# EAGLE board Aeternum_V1_2 (EAGLE 9.1.1)
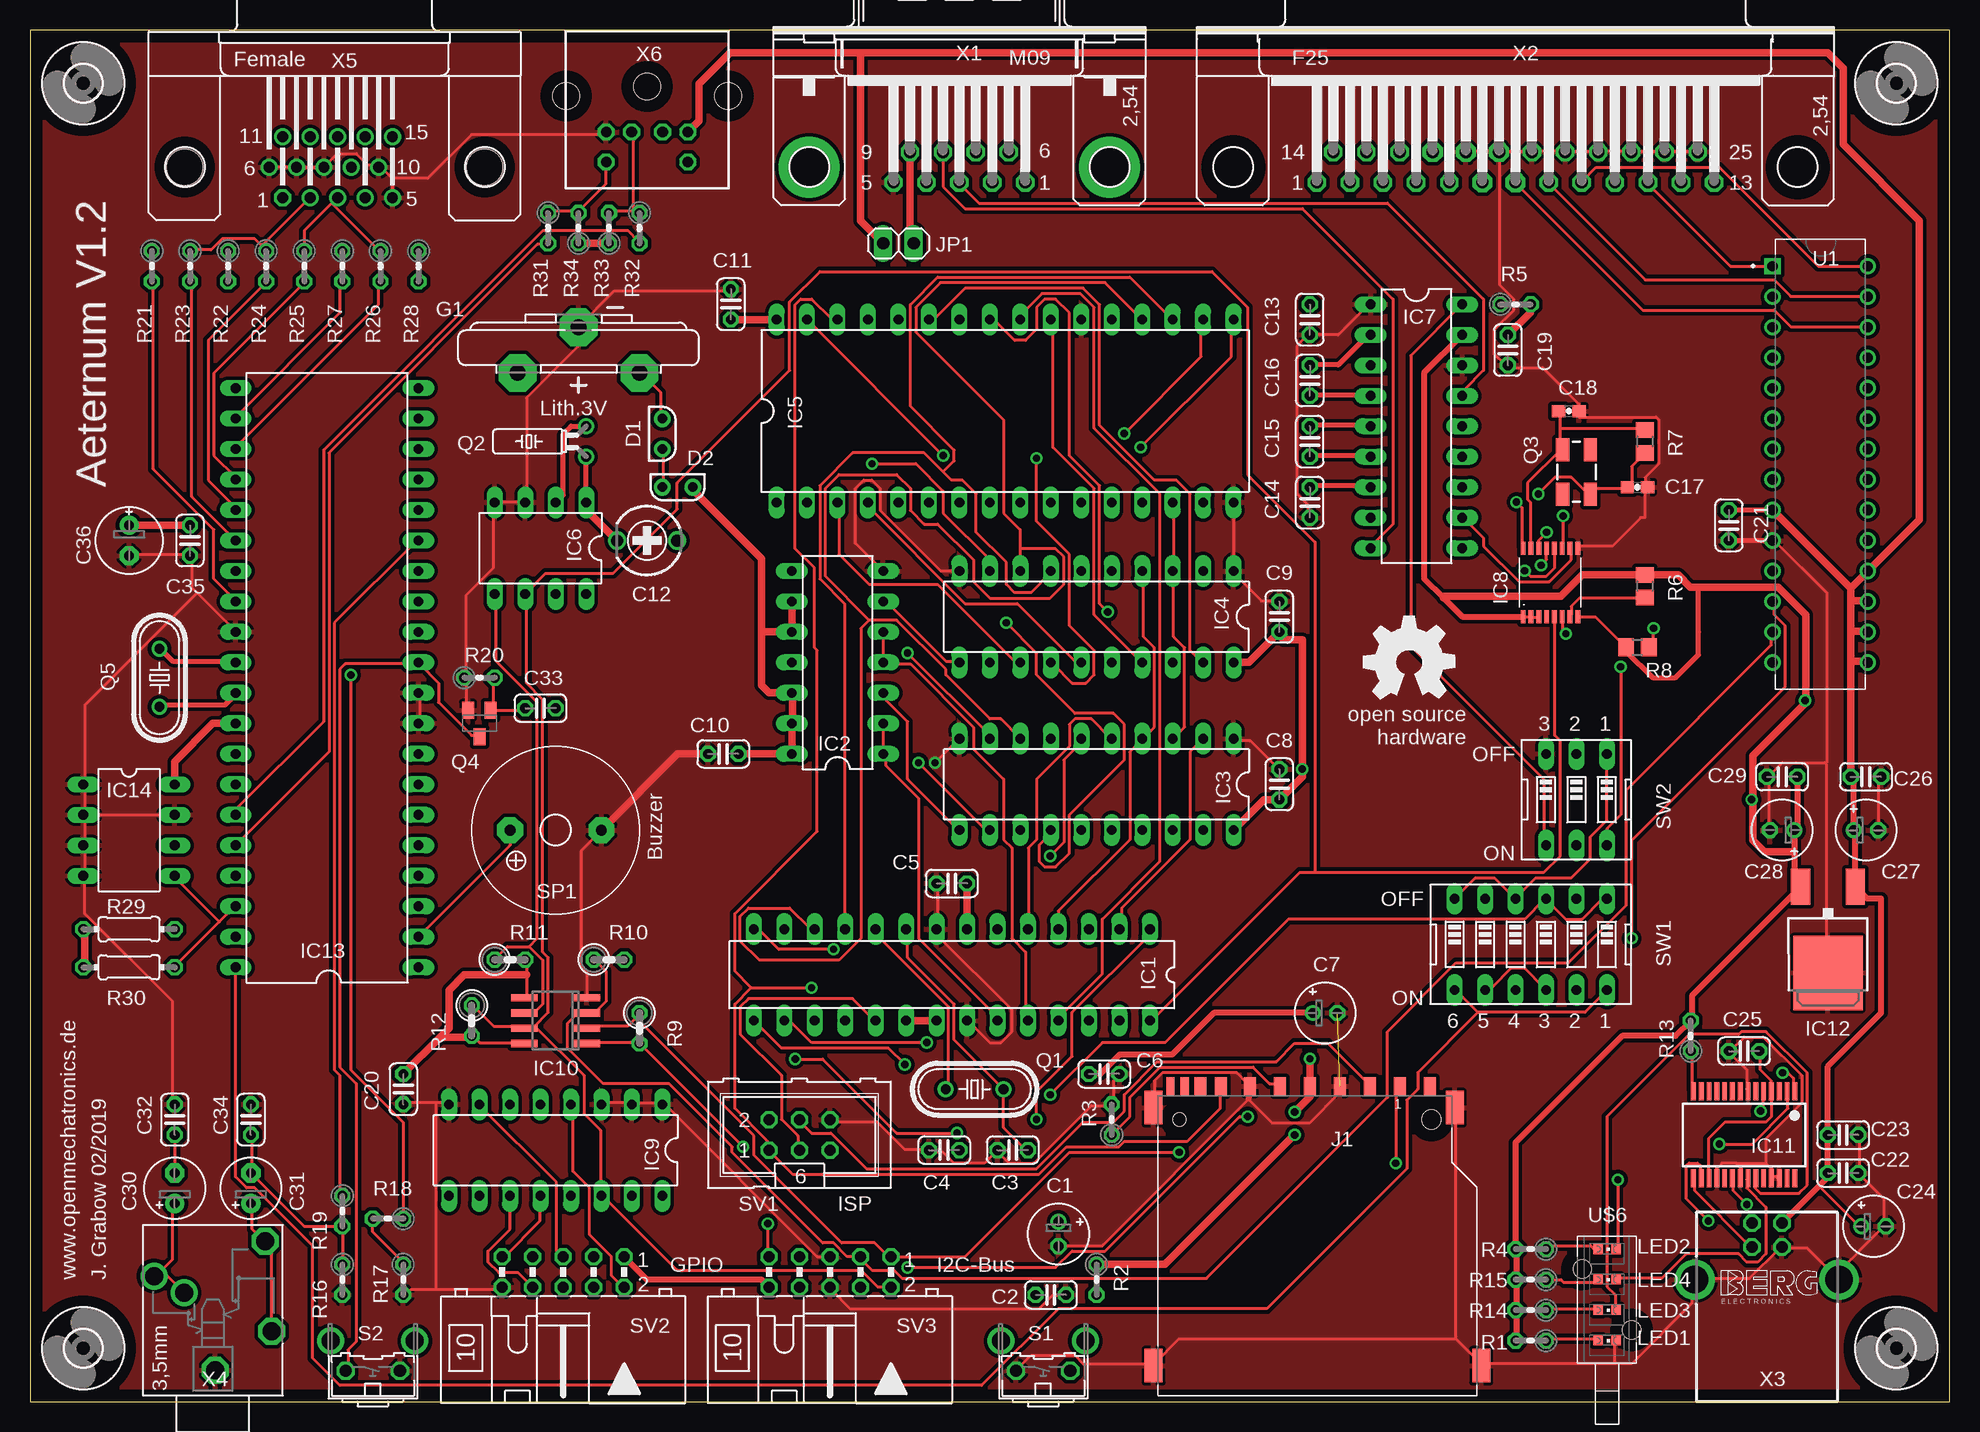
[diagram p5: board, top side]
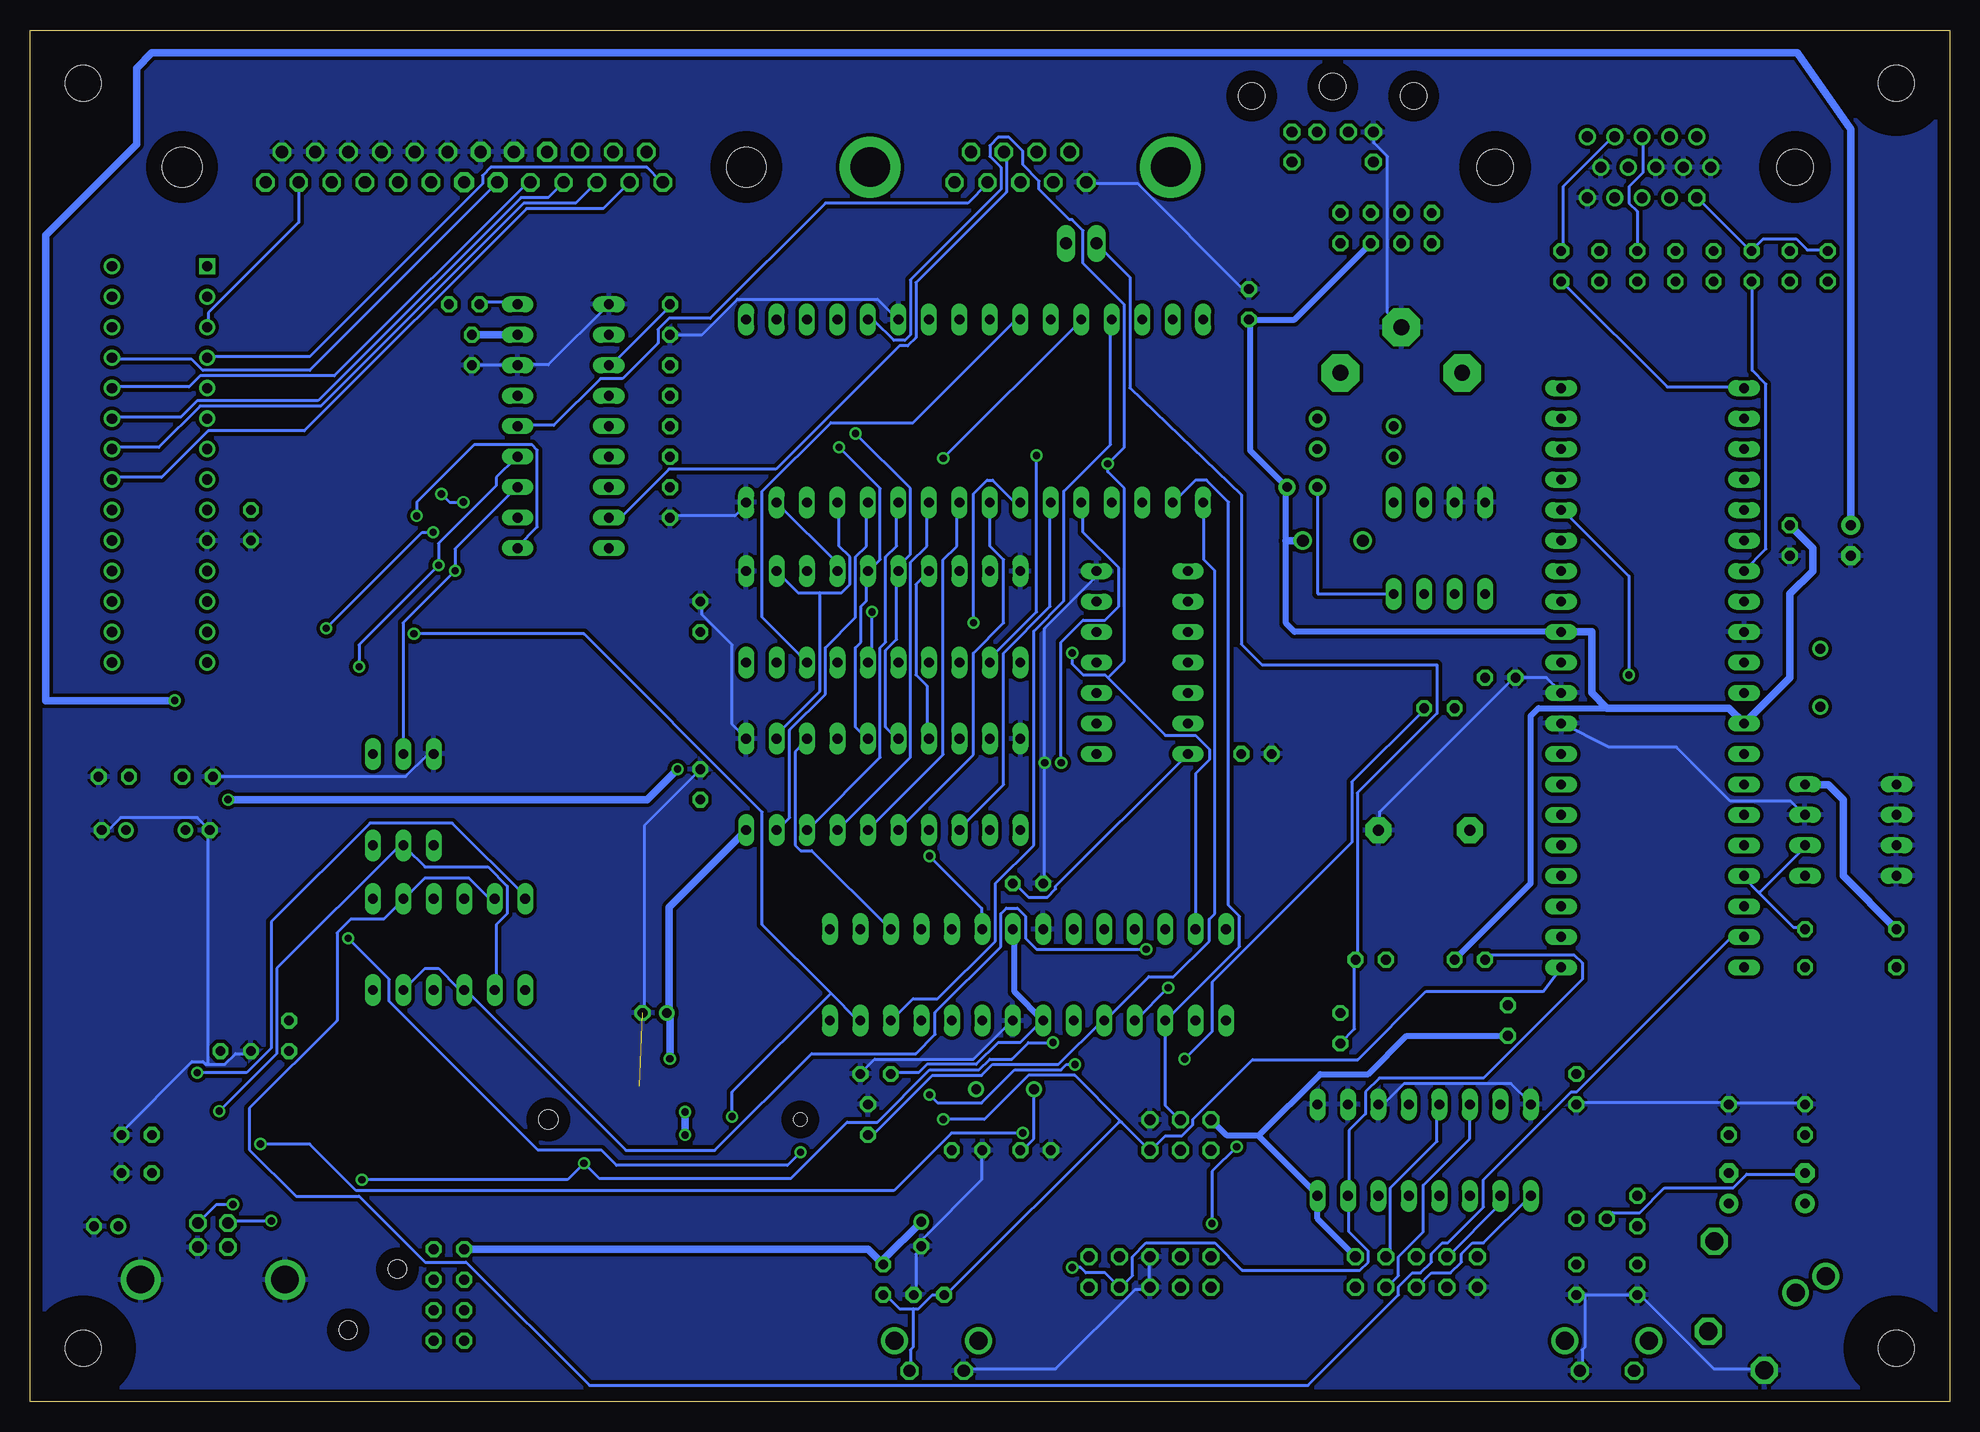
[diagram p6: board, bottom side, seen from below]

Size 160.02 x 114.3 mm. Coordinates in mm from the lower left corner, seen from the top.
Outline: 160.02,0 160.02,114.3 0,114.3 0,0 160.02,0
Copper layers (1*16): Top 0.035mm / dielectric 1.5mm / Bottom 0.035mm
Design rules "default": minimum track width 10mil, minimum drill 24mil, track to track 8mil, track to pad 8mil, pad to pad 8mil, via to via 8mil, smd to smd 8mil, copper to edge 40mil, drill to drill 8mil, minimum pad ring 10mil, minimum via ring 8mil, stop-mask expansion 4mil, vias tented up to drill 0mil, thermal gap 10mil

## Footprints (pad centres in the part's own frame; a part is rotated, then mirrored left to right if it is on the bottom)
E2-5 = drill 0.813 pad 1.27: + -1.016,0 | drill 0.813 pad 1.27 octagon: - 1.016,0
C025-024X044 = drill 0.813 octagon: 1 -1.27,0; 2 1.27,0
CTRIMTZ03 = drill 1: 1 0,2.5; 2 0,-2.5
0603-CAP = smd 1.1 x 1: 1 -0.85,0; 2 0.85,0
E2,5-5 = drill 0.813 pad 1.6: + -1.27,0 | drill 0.813 pad 1.6 octagon: - 1.27,0
E2,5-6E = drill 0.813 pad 1.575: + -1.27,0 | drill 0.813 pad 1.575 octagon: - 1.27,0
E2LINE = drill 0.8 pad 1.397: 1 0,-1.27; 2 0,1.27
KZH20PCB-V = drill 1.321 pad 3.15 octagon: + 0,-5.08; +@1 0,5.08; - 3.81,0
DIL28-3 = drill 0.813 long: 1 -16.51,-3.81; 2 -13.97,-3.81; 3 -11.43,-3.81; 4 -8.89,-3.81; 5 -6.35,-3.81; 6 -3.81,-3.81; 7 -1.27,-3.81; 8 1.27,-3.81; 9 3.81,-3.81; 10 6.35,-3.81; 11 8.89,-3.81; 12 11.43,-3.81; 13 13.97,-3.81; 14 16.51,-3.81; 15 16.51,3.81; 16 13.97,3.81; 17 11.43,3.81; 18 8.89,3.81; 19 6.35,3.81; 20 3.81,3.81; 21 1.27,3.81; 22 -1.27,3.81; 23 -3.81,3.81; 24 -6.35,3.81; 25 -8.89,3.81; 26 -11.43,3.81; 27 -13.97,3.81; 28 -16.51,3.81
DIL14 = drill 0.813 long: 1 -7.62,-3.81; 2 -5.08,-3.81; 3 -2.54,-3.81; 4 0,-3.81; 5 2.54,-3.81; 6 5.08,-3.81; 7 7.62,-3.81; 8 7.62,3.81; 9 5.08,3.81; 10 2.54,3.81; 11 0,3.81; 12 -2.54,3.81; 13 -5.08,3.81; 14 -7.62,3.81
DIL20 = drill 0.813 long: 1 -11.43,-3.81; 2 -8.89,-3.81; 3 -6.35,-3.81; 4 -3.81,-3.81; 5 -1.27,-3.81; 6 1.27,-3.81; 7 3.81,-3.81; 8 6.35,-3.81; 9 8.89,-3.81; 10 11.43,-3.81; 11 11.43,3.81; 12 8.89,3.81; 13 6.35,3.81; 14 3.81,3.81; 15 1.27,3.81; 16 -1.27,3.81; 17 -3.81,3.81; 18 -6.35,3.81; 19 -8.89,3.81; 20 -11.43,3.81
DIL32 = drill 0.813 long: 1 -17.78,-7.62; 2 -15.24,-7.62; 3 -12.7,-7.62; 4 -10.16,-7.62; 5 -7.62,-7.62; 6 -5.08,-7.62; 7 -2.54,-7.62; 8 0,-7.62; 9 2.54,-7.62; 10 5.08,-7.62; 11 7.62,-7.62; 12 10.16,-7.62; 13 12.7,-7.62; 14 15.24,-7.62; 15 17.78,-7.62; 16 20.32,-7.62; 17 20.32,7.62; 18 17.78,7.62; 19 15.24,7.62; 20 12.7,7.62; 21 10.16,7.62; 22 7.62,7.62; 23 5.08,7.62; 24 2.54,7.62; 25 0,7.62; 26 -2.54,7.62; 27 -5.08,7.62; 28 -7.62,7.62; 29 -10.16,7.62; 30 -12.7,7.62; 31 -15.24,7.62; 32 -17.78,7.62
DIL08 = drill 0.813 long: 1 -3.81,-3.81; 2 -1.27,-3.81; 3 1.27,-3.81; 4 3.81,-3.81; 5 3.81,3.81; 6 1.27,3.81; 7 -1.27,3.81; 8 -3.81,3.81
DIL18 = drill 0.813 long: 1 -10.16,-3.81; 2 -7.62,-3.81; 3 -5.08,-3.81; 4 -2.54,-3.81; 5 0,-3.81; 6 2.54,-3.81; 7 5.08,-3.81; 8 7.62,-3.81; 9 10.16,-3.81; 10 10.16,3.81; 11 7.62,3.81; 12 5.08,3.81; 13 2.54,3.81; 14 0,3.81; 15 -2.54,3.81; 16 -5.08,3.81; 17 -7.62,3.81; 18 -10.16,3.81
RICKK2_SC16IS740 = smd 0.4 x 1.1: 1 0,0; 2 0.65,0; 3 1.3,0; 4 1.95,0; 5 2.6,0; 6 3.25,0; 7 3.9,0; 8 4.55,0; 9 4.55,5.7; 10 3.9,5.7; 11 3.25,5.7; 12 2.6,5.7; 13 1.95,5.7; 14 1.3,5.7; 15 0.65,5.7; 16 0,5.7
DIL16 = drill 0.813 long: 1 -8.89,-3.81; 2 -6.35,-3.81; 3 -3.81,-3.81; 4 -1.27,-3.81; 5 1.27,-3.81; 6 3.81,-3.81; 7 6.35,-3.81; 8 8.89,-3.81; 9 8.89,3.81; 10 6.35,3.81; 11 3.81,3.81; 12 1.27,3.81; 13 -1.27,3.81; 14 -3.81,3.81; 15 -6.35,3.81; 16 -8.89,3.81
SO-08 = smd 0.6 x 2.2: 1 -1.905,-2.6; 2 -0.635,-2.6; 3 0.635,-2.6; 4 1.905,-2.6; 5 1.905,2.6; 6 0.635,2.6; 7 -0.635,2.6; 8 -1.905,2.6
SSOP28 = smd 0.4 x 1.5: 1 -4.225,-3.625; 2 -3.575,-3.625; 3 -2.925,-3.625; 4 -2.275,-3.625; 5 -1.625,-3.625; 6 -0.975,-3.625; 7 -0.325,-3.625; 8 0.325,-3.625; 9 0.975,-3.625; 10 1.625,-3.625; 11 2.275,-3.625; 12 2.925,-3.625; 13 3.575,-3.625; 14 4.225,-3.625; 15 4.225,3.625; 16 3.575,3.625; 17 2.925,3.625; 18 2.275,3.625; 19 1.625,3.625; 20 0.975,3.625; 21 0.325,3.625; 22 -0.325,3.625; 23 -0.975,3.625; 24 -1.625,3.625; 25 -2.275,3.625; 26 -2.925,3.625; 27 -3.575,3.625; 28 -4.225,3.625
DPACK = smd 1.6 x 3: 1 -2.28,-4.8; 3 2.28,-4.8 | smd 5.8 x 6.2: 4 0,2.38
DIL40 = drill 0.813 long: 1 -22.86,-7.62; 2 -20.32,-7.62; 3 -17.78,-7.62; 4 -15.24,-7.62; 5 -12.7,-7.62; 6 -10.16,-7.62; 7 -7.62,-7.62; 8 -5.08,-7.62; 9 -2.54,-7.62; 10 0,-7.62; 11 2.54,-7.62; 12 5.08,-7.62; 13 7.62,-7.62; 14 10.16,-7.62; 15 12.7,-7.62; 16 15.24,-7.62; 17 17.78,-7.62; 18 20.32,-7.62; 19 22.86,-7.62; 20 25.4,-7.62; 21 25.4,7.62; 22 22.86,7.62; 23 20.32,7.62; 24 17.78,7.62; 25 15.24,7.62; 26 12.7,7.62; 27 10.16,7.62; 28 7.62,7.62; 29 5.08,7.62; 30 2.54,7.62; 31 0,7.62; 32 -2.54,7.62; 33 -5.08,7.62; 34 -7.62,7.62; 35 -10.16,7.62; 36 -12.7,7.62; 37 -15.24,7.62; 38 -17.78,7.62; 39 -20.32,7.62; 40 -22.86,7.62
DIL8 = drill 0.813 long: 1 -3.81,-3.81; 2 -1.27,-3.81; 3 1.27,-3.81; 4 3.81,-3.81; 5 3.81,3.81; 6 1.27,3.81; 7 -1.27,3.81; 8 -3.81,3.81
693063010911 = smd 1 x 1.5: 1 6.875,2.8; 2 4.375,2.8; 3 1.875,2.8; 4 -0.625,2.8; 5 -3.125,2.8; 6 -5.625,2.8; 7 -8.05,2.8; 8 -9.75,2.8; 9 9.375,2.8 | smd 0.7 x 1.5: CDI -11.05,2.8; WP -12.25,2.8 | smd 1.5 x 2.8: Z1 -13.65,1; Z2 11.45,1; Z3 13.65,-20.5; Z4 -13.65,-20.5 | hole 1.1: -11.5,0 | hole 1.6: 9.5,0
1X02 = drill 1.016 long: 1 -1.27,0; 2 1.27,0
CHIPLED_0603 = smd 0.8 x 0.8: A 0,-0.75; C 0,0.75
HC49/S = drill 0.813: 1 -2.413,0; 2 2.413,0
TC26H = drill 0.813: 1 -1.27,0; 2 1.27,0
CRYSTAL-SMD-5X3 = smd 1.9 x 1.1: 1 -1.85,-1.15; 2 1.85,-1.15; 3 1.85,1.15; 4 -1.85,1.15
SOT23-BEC = smd 1 x 1.4: B -0.95,-1.1; C 0,1.1; E 0.95,-1.1
0204V = drill 0.813 octagon: 1 -1.27,0; 2 1.27,0
R0805 = smd 1.3 x 1.5: 1 -0.95,0; 2 0.95,0
0207/2V = drill 0.813 octagon: 1 -1.27,0; 2 1.27,0
0204/7 = drill 0.813 octagon: 1 -3.81,0; 2 3.81,0
B3F-31XX = drill 1.016 octagon: 1 -2.261,-1.245; 2 2.261,-1.245 | drill 1.499 pad 2.159: 3 -3.505,1.245; 4 3.505,1.245
KSS1201 = drill 0.914 pad 2.159 octagon: + 3.81,0; - -3.81,0
ML6 = drill 0.914 octagon: 1 -2.54,-1.27; 2 -2.54,1.27; 3 0,-1.27; 4 0,1.27; 5 2.54,-1.27; 6 2.54,1.27
ML10L = drill 0.914 octagon: 1 -5.08,-1.27; 2 -5.08,1.27; 3 -2.54,-1.27; 4 -2.54,1.27; 5 0,-1.27; 6 0,1.27; 7 2.54,-1.27; 8 2.54,1.27; 9 5.08,-1.27; 10 5.08,1.27
EDG-06 = drill 0.813 long: 1 -6.35,-3.81; 2 -3.81,-3.81; 3 -1.27,-3.81; 4 1.27,-3.81; 5 3.81,-3.81; 6 6.35,-3.81; 7 6.35,3.81; 8 3.81,3.81; 9 1.27,3.81; 10 -1.27,3.81; 11 -3.81,3.81; 12 -6.35,3.81
EDG-03 = drill 0.813 long: 1 -2.54,-3.81; 2 0,-3.81; 3 2.54,-3.81; 4 2.54,3.81; 5 0,3.81; 6 -2.54,3.81
DIP793W45P254L3556H508Q28 = drill 0.85 square: 1 -3.969,16.51 | drill 0.85: 2 -3.969,13.97; 3 -3.969,11.43; 4 -3.969,8.89; 5 -3.969,6.35; 6 -3.969,3.81; 7 -3.969,1.27; 8 -3.969,-1.27; 9 -3.969,-3.81; 10 -3.969,-6.35; 11 -3.969,-8.89; 12 -3.969,-11.43; 13 -3.969,-13.97; 14 -3.969,-16.51; 15 3.969,-16.51; 16 3.969,-13.97; 17 3.969,-11.43; 18 3.969,-8.89; 19 3.969,-6.35; 20 3.969,-3.81; 21 3.969,-1.27; 22 3.969,1.27; 23 3.969,3.81; 24 3.969,6.35; 25 3.969,8.89; 26 3.969,11.43; 27 3.969,13.97; 28 3.969,16.51
3,0 = hole 3: 0,0
OPTO_THT_LWL_MENTOR_1296_1004 = hole 1.5: -2.05,12.96; 2.05,7.88
M09HP = drill 1.016 octagon: 1 -5.486,1.27; 2 -2.743,1.27; 3 0,1.27; 4 2.743,1.27; 5 5.486,1.27; 6 -4.115,-1.27; 7 -1.372,-1.27; 8 1.372,-1.27; 9 4.115,-1.27 | drill 3.302 pad 5.08: G1 -12.522,0; G2 12.522,0
F25H = drill 1.016 octagon: 1 -16.561,-1.27; 2 -13.792,-1.27; 3 -11.049,-1.27; 4 -8.28,-1.27; 5 -5.512,-1.27; 8 2.769,-1.27; 9 5.512,-1.27; 10 8.28,-1.27; 11 11.049,-1.27; 12 13.792,-1.27; 13 16.561,-1.27; 14 -15.189,1.27; 15 -12.421,1.27; 16 -9.652,1.27; 20 1.372,1.27; 21 4.14,1.27; 22 6.909,1.27; 23 9.652,1.27; 24 12.421,1.27; 25 15.189,1.27 | drill 1.016 pad 1.67 octagon: 6 -2.769,-1.27; 7 0,-1.27; 17 -6.909,1.27; 18 -4.14,1.27; 19 -1.372,1.27 | hole 3.302: -23.52,0; 23.52,0
PN61729-S = drill 0.95 octagon: 1 1.25,4.71; 2 -1.25,4.71; 3 -1.25,2.71; 4 1.25,2.71 | drill 2.3 pad 2.9: S1 -6.02,0; S2 6.02,0
PG203J = drill 1.499 octagon: 1 -5.004,-0.203; 4 5.74,-4.369; 5 -1.753,-4.902 | drill 1.499: 2 2.845,4.902; 3 1.448,2.388
HDF15H = drill 0.9 octagon: 1 4.329,2.54 | drill 0.9: 2 2.043,2.54; 3 -0.243,2.54; 4 -2.529,2.54; 5 -4.815,2.54; 6 5.472,0; 7 3.186,0; 8 0.9,0; 9 -1.386,0; 10 -3.672,0; 11 4.329,-2.54; 12 2.043,-2.54; 13 -0.243,-2.54; 14 -2.529,-2.54; 15 -4.815,-2.54 | hole 3: -12.5,0; 12.5,0
SSV-BC06 = drill 0.9 octagon: 1 1.3,8.5; 2 -1.3,8.5; 3 3.4,8.5; 4 -3.4,8.5; 5 3.4,11; 6 -3.4,11 | hole 2.2: -6.75,5.5; 0,4.7; 6.75,5.5

## Placement (x,y rotation side)
C1  10µ  [E2-5]  85.72,13.97 270 top
C2  100n  [C025-024X044]  85.09,8.89 180 top
C3  27p  [C025-024X044]  81.91,20.95 180 top
C4  27p  [C025-024X044]  76.2,20.95 180 top
C5  100n  [C025-024X044]  76.83,43.18 180 top
C6  100n  [C025-024X044]  89.53,27.3 180 top
C7  4,7µ  [E2-5]  107.95,32.38 0 top
C8  100n  [C025-024X044]  104.14,51.44 90 top
C9  100n  [C025-024X044]  104.14,65.41 90 top
C10  100n  [C025-024X044]  57.79,53.98 180 top
C11  100n  [C025-024X044]  58.42,91.44 90 top
C12  6-20 pF  [CTRIMTZ03]  51.44,71.75 270 top
C13  100n  [C025-024X044]  106.68,90.17 270 top
C14  100n  [C025-024X044]  106.68,74.93 270 top
C15  100n  [C025-024X044]  106.68,80.01 270 top
C16  100n  [C025-024X044]  106.68,85.09 90 top
C17  18pF  [0603-CAP]  133.99,76.2 0 top
C18  18pF  [0603-CAP]  128.27,82.55 0 top
C19  100n  [C025-024X044]  123.19,87.63 90 top
C20  100n  [C025-024X044]  31.11,26.04 90 top
C21  100n  [C025-024X044]  141.61,73.03 270 top
C22  10n  [C025-024X044]  151.13,19.05 180 top
C23  100n  [C025-024X044]  151.13,22.23 180 top
C24  10µ  [E2-5]  153.67,14.61 0 top
C25  100n  [C025-024X044]  142.88,29.21 0 top
C26  100n  [C025-024X044]  153.03,52.07 180 top
C27  10µ  [E2-5]  153.03,47.62 0 top
C28  10µ  [E2-5]  146.05,47.62 180 top
C29  100n  [C025-024X044]  146.05,52.07 0 top
C30  10µ  [E2,5-5]  12.06,17.78 90 top
C31  10µ  [E2,5-5]  18.41,17.78 90 top
C32  33n  [C025-024X044]  12.06,23.5 90 top
C33  10n  [C025-024X044]  42.55,57.78 180 top
C34  33n  [C025-024X044]  18.41,23.5 90 top
C35  100n  [C025-024X044]  13.34,71.75 90 top
C36  10µ  [E2,5-6E]  8.26,71.75 270 top
D1  BAT43  [E2LINE]  52.71,80.64 0 top
D2  BAT43  [E2LINE]  53.98,76.2 270 top
G1  CR2032VKZH  [KZH20PCB-V]  45.72,85.72 90 top
IC1  ATMEGA 328-PU  [DIL28-3]  76.83,35.56 180 top
IC2  74HC00N  [DIL14]  67.31,61.59 90 top
IC3  74HC574N  [DIL20]  88.9,51.44 180 top
IC4  74HC574N  [DIL20]  88.9,65.41 180 top
IC5  AS6C4008  [DIL32]  80.01,82.55 0 top
IC6  PCF8583P  [DIL08]  42.55,71.12 180 top
IC7  MAX3222  [DIL18]  115.57,81.28 270 top
IC8  SC16IS740  [RICKK2_SC16IS740]  124.46,65.41 0 top
IC9  PCF8574P  [DIL16]  43.82,20.95 180 top
IC10  PCA9517  [SO-08]  43.82,31.75 90 top
IC11  FT232RL  [SSOP28]  142.88,22.23 180 top
IC12  LP2950CDT-3.3  [DPACK]  149.86,38.1 180 top
IC13  P8X32A-D40  [DIL40]  24.76,59.05 90 top
IC14  24LC256P  [DIL8]  8.26,47.62 270 top
J1  Würth 693063010911  [693063010911]  107.31,23.5 0 top
JP1  RI-Power  [1X02]  72.39,96.52 0 top
LED1  Grün  [CHIPLED_0603]  131.45,5.08 270 top
LED2  Gelb  [CHIPLED_0603]  131.45,12.7 270 top
LED3  Rot  [CHIPLED_0603]  131.45,7.62 270 top
LED4  Grün  [CHIPLED_0603]  131.45,10.16 270 top
Q1  20 MHz  [HC49/S]  78.74,26.04 0 top
Q2  32.768 kHz  [TC26H]  46.36,80.01 90 top
Q3  14.7456MHz  [CRYSTAL-SMD-5X3]  128.91,77.47 270 top
Q4  BC817-25SMD  [SOT23-BEC]  37.47,56.52 180 top
Q5  5 MHz  [HC49/S]  10.79,60.33 270 top
R1  270  [0204V]  125.09,5.08 180 top
R2  10k  [0204V]  88.9,10.16 270 top
R3  10k  [0204V]  90.17,23.5 90 top
R4  330  [0204V]  125.09,12.7 180 top
R5  10k  [0204V]  123.82,91.44 0 top
R6  1k  [R0805]  134.62,67.94 90 top
R7  1M  [R0805]  134.62,80.01 90 top
R8  1k  [R0805]  133.99,62.87 0 top
R9  10k  [0207/2V]  50.8,31.11 270 top
R10  10k  [0207/2V]  48.26,36.83 0 top
R11  10k  [0207/2V]  40.01,36.83 0 top
R12  10k  [0207/2V]  36.83,31.75 270 top
R13  10k  [0204V]  138.43,30.48 90 top
R14  390  [0204V]  125.09,7.62 180 top
R15  270  [0204V]  125.09,10.16 180 top
R16  150  [0204V]  26.04,10.16 270 top
R17  150  [0204V]  31.11,10.16 270 top
R18  270  [0204V]  29.84,15.24 180 top
R19  270  [0204V]  26.04,15.88 270 top
R20  10k  [0204V]  37.47,60.33 0 top
R21  240  [0204V]  10.16,94.61 270 top
R22  470  [0204V]  16.51,94.61 270 top
R23  240  [0204V]  13.34,94.61 270 top
R24  470  [0204V]  19.68,94.61 270 top
R25  240  [0204V]  22.86,94.61 270 top
R26  470  [0204V]  29.21,94.61 270 top
R27  240  [0204V]  26.04,94.61 270 top
R28  240  [0204V]  32.39,94.61 270 top
R29  10k  [0204/7]  8.26,39.37 0 top
R30  10k  [0204/7]  8.26,36.2 0 top
R31  100  [0204V]  43.18,97.79 270 top
R32  100  [0204V]  50.8,97.79 270 top
R33  10k  [0204V]  48.26,97.79 90 top
R34  10k  [0204V]  45.72,97.79 90 top
S1  CP/M Reset  [B3F-31XX]  84.45,3.81 0 top
S2  VT100 Reset  [B3F-31XX]  28.57,3.81 0 top
SP1  RMP-14SP  [KSS1201]  43.82,47.62 180 top
SV1  ISP  [ML6]  64.13,22.23 0 top
SV2  GPIO 3.3V Port  [ML10L]  44.45,10.79 180 top
SV3  I2C Bus  [ML10L]  66.67,10.79 180 top
SW1  Mode Switch  [EDG-06]  125.09,38.1 180 top
SW2  Mode Switch  [EDG-03]  128.91,50.16 180 top
U1  MCP23017-E/SP  [DIP793W45P254L3556H508Q28]  149.23,78.11 0 top
U$1  [3,0]  4.45,109.86 0 top
U$2  [3,0]  155.58,109.86 0 top
U$3  [3,0]  155.58,4.45 0 top
U$4  [3,0]  4.45,4.45 0 top
U$6  [OPTO_THT_LWL_MENTOR_1296_1004]  131.45,-1.91 0 top
U$7  [OSHW_8MM]  114.93,61.59 0 top
X1  DE9 Male  [M09HP]  77.47,102.87 180 top
X2  DE25 Female  [F25H]  123.82,102.87 0 top
X3  USB-B  [PN61729-S]  144.78,10.16 0 top
X4  PG203J  [PG203J]  15.24,7.62 90 top
X5  DB-15 female  [HDF15H]  25.4,102.87 180 top
X6  Mini-DIN 6 pol  [SSV-BC06]  51.44,114.3 180 top

## Tracks (layer width: path | path; a pad name or v marks a point on that pad's centre or on a via)
!CTS  (via drill 0.61)
  Top 0.254: v127.79,73.81 127.79,71.3 IC8.11
  Bottom 0.254: v127.79,73.81 127.79,74.95 122.99,79.76 118.19,79.76 117.73,79.3 117.73,72.9 119.33,71.3 IC7.10
!RTS
  Top 0.254: IC8.10 128.47,71.07 128.47,70.16 126.64,68.33 124.13,68.33 121.16,71.3 121.16,71.98 119.56,73.58 IC7.11
+3V3  (via drill 0.61)
  Top 0.254: R11.2 41.38,36.78 41.38,35.56 41.38,33.81 IC10.5 | IC10.8 41.15,29.92 37.49,29.92 37.03,30.38 R12.2 36.8,30.38 | R30.1 4.57,36.32 | 4.57,39.29 R29.1 | 125.04,91.42 R5.2 125.04,91.42 | IC8.1 124.59,65.35 125.04,65.35 IC8.2 125.27,65.35 125.73,65.35 IC8.3 | 132.82,63.07 130.53,65.35 129.16,65.35 IC8.8 | 123.9,5.23 R1.2 | 123.9,10.26 R15.2 123.9,10.26 | 138.53,31.75 R13.2 | IC12.3 147.45,42.72 | 55.09,76.1 D2.2 | 75.44,31.75 IC1.21 | 104.01,63.98 C9.1 | 143.61,50.27 143.56,50.27 v143.51,50.16 | 63.55,56.67 IC2.13 | R4.2 123.9,12.78 123.9,12.62 | IC2.12 63.55,59.18 63.55,58.95 | 123.9,10.26 123.9,10.08 | 125.04,91.42 125.04,90.96 125.04,90.75 | 123.9,7.75 R14.2 123.9,7.75
  Top 0.406: 133.03,62.55 135.25,60.33 137.16,60.33 139.06,62.23 139.06,64.14 139.06,67.86
  Top 0.508: C29.2 147.32,47.88 C28.+ 147.07,46.61 147.07,46.35 147.07,45.82 147.07,43.41 IC12.3 | C7.+ 98.68,32.38 95.2,28.91 90.82,28.91 89.22,27.3 C6.2 | 147.45,42.72 138.53,33.81 138.53,31.75 | R13.2 137.16,30.48 132.72,30.48 123.82,21.59 R4.2 | SV3.10 60.96,10.16 51.44,10.16 SV2.1 | 123.9,12.62 123.9,10.26 123.9,10.08 | 123.9,10.08 123.9,7.75 | 123.9,7.75 123.9,7.62 | 123.9,7.62 123.9,5.23 | 123.9,10.08 123.9,7.75 | 123.9,7.75 123.9,7.62 | IC7.17 116.2,85.72 116.2,68.58 117.79,66.99 119.38,65.41 IC8.1
  Top 0.61: 147.07,45.82 144.55,45.82 143.61,46.76 143.61,50.27 143.61,53.82 148.03,58.24 148.03,65.58 145.75,67.86 139.06,67.86 138.41,67.86 137.38,68.89 R6.2 129.38,68.89 127.59,67.1 117.9,67.1 117.79,66.99 | IC1.20 75.44,31.75 | IC1.7 C5.1 | IC3.20 102.87,50.16 C8.1 106.05,52.07 v106.05,52.7 106.05,63.5 104.5,63.5 104.01,63.98 | C9.1 101.6,61.59 IC4.20 | 63.55,56.67 63.55,58.95 | 60.96,64.14 60.96,70.23 55.09,76.1 | IC2.9 IC2.10 60.96,64.14 | IC13.32 15.24,56.52 12.06,53.34 IC14.8 | R30.1 4.57,36.32 4.57,39.29 | C20.2 34.19,30.38 | 34.19,30.38 36.8,30.38 | 34.19,30.38 34.93,31.11 34.93,34.29 36.2,35.56 41.38,35.56 | IC5.32 C11.1 | C19.2 125.04,90.75 | R34.1 R33.1 | v105.41,22.23 94.61,11.43 R2.1 | v106.68,28.57 106.68,26.3 J1.4 106.69,25.41 v105.41,24.13 | IC2.13 IC2.14 C10.1 | 132.82,63.07 132.83,63.07 R8.1 133.03,62.55 | IC2.12 61.59,59.05 60.96,59.69 60.96,64.14 | C35.2 C36.+ C35.2
  Bottom 0.254: 57.61,22.15 57.56,22.2 | 32.23,63.98 IC13.12 | 11.89,51.41 IC14.8 | 122.99,88.9 C19.2 | 58.29,90.27 C11.1 | 55.32,76.33 D2.2 | 75.67,31.75 77.49,29.92 79.32,29.92 81.15,28.09 85.27,28.09 85.95,27.41 88.24,27.41 C6.2 | 75.67,31.75 IC1.21 75.67,31.75 | 77.95,39.29 IC1.7 | 106.76,32.44 C7.+ | IC2.14 63.55,53.92 74.52,42.95 74.52,42.72 75.21,42.04 76.81,42.04 77.95,43.18 C5.1
  Bottom 0.508: R11.2 34.93,43.18 34.93,57.15 34.29,57.78 27.3,57.78 | IC13.12 54.61,64.14 55.32,64.85 55.32,71.75 55.32,76.33 | D2.2 58.29,79.25 58.29,90.27 | C11.1 54.61,90.17 R33.1 | SV2.1 52.71,15.24 IC9.16 52.71,17.25 57.61,22.15 52.48,27.28 48.48,27.28 45.27,30.48 R12.2 | SV1.2 60.3,22.2 57.56,22.2 | IC1.21 77.95,34.14 77.95,39.29
  Bottom 0.61: R29.1 8.89,43.81 8.89,50.16 10.13,51.41 11.89,51.41 | IC3.20 106.76,41.2 106.76,32.44 106.68,32.36 v106.68,28.57 | R4.2 90.17,12.7 R2.1 88.9,11.81 C1.+ | IC7.17 122.99,88.9 | C35.2 11.43,71.12 11.43,69.22 13.34,67.31 13.34,60.33 IC13.32 18.41,57.78 27.3,57.78 28.57,57.78 29.84,59.05 29.84,64.14 32.08,64.14 32.23,63.98 | v147.96,58.42 158.7,58.42 158.7,97.21 151.13,104.78 151.13,111.12 149.86,112.39 12.7,112.39 8.26,106.05 C36.+ | v106.05,52.7 108.58,50.16 v143.51,50.16 | v105.41,24.13 v105.41,22.23 | 55.32,71.75 C12.1
+5V  (via drill 0.61)
  Top 0.254: IC10.1 46.63,29.92 50.75,29.92 R9.2 50.98,29.69 v59.44,21.23 | v61.49,14.83 61.49,12.09 SV3.9 | v143.1,16.43 141.96,17.58 141.96,18.49 IC11.20 | C24.+ 152.48,14.61 149.28,17.8 149.12,17.96 | 153.16,61.7 U1.15 | 152.02,61.7 151.77,61.7 | 153.16,64.21 U1.16 | 152.02,64.21 151.77,64.21 | 153.16,66.73 U1.17 | 152.02,66.73 151.77,66.73
  Top 0.406: U1.9 C21.1
  Top 0.508: X3.1 149.12,17.96 149.86,18.7 C22.2 C23.2 149.86,27.94 154.31,32.38 154.31,41.91 153.13,41.91 IC12.1 152.14,47.5 C27.+ 152.02,51.82 C26.2
  Top 0.61: C26.2 151.77,61.7 151.77,64.21 151.77,66.73 151.77,67.31 | 151.77,67.79 151.77,67.31 | 151.77,67.79 U1.18 157.48,73.5 157.48,98.42 151.13,104.78 151.13,111.12 149.86,112.39 70.87,112.39 69.21,112.39 | U1.9 151.77,67.79 | 151.77,67.79 151.77,67.31 | X6.4 55.76,106.73 55.76,109.8 58.36,112.39 69.21,112.39 | 152.02,61.7 153.16,61.7 | 152.02,64.21 153.16,64.21 | 152.02,66.73 153.16,66.73 | JP1.1 69.21,98.42 69.21,112.39
  Bottom 0.254: R9.2 50.75,29.92 49.61,31.06 49.61,36.78 R10.2 49.38,37.01 49.38,50.72 42.75,57.35 42.75,61.4 57.33,61.4 59.05,63.12 59.05,75.56 68.35,84.48 68.35,93.7 71.09,96.44 JP1.1 | v61.49,14.83 61.49,19.18 v59.44,21.23 | v143.1,16.43 144.48,16.43 145.85,15.06 X3.1 | 145.16,74.27 U1.9
/CAS
  Top 0.254: IC2.5 71.09,63.98 71.09,61.7 IC2.4 71.32,61.47 73.38,61.47 78.64,56.21 78.64,54.38 81.15,51.87 81.15,46.84 81.84,46.15 81.84,38.61 82.98,37.47 82.98,31.75 IC1.24
/OE
  Top 0.254: IC1.25 85.72,31.98 89.38,35.64 89.38,40.21 94.18,45.01 94.18,75.64 88.7,81.13 88.7,91.19 87.55,92.33 84.35,92.33 82.75,90.73 82.75,90.27 IC5.24
/RAS
  Top 0.254: IC2.2 71.09,56.44 71.09,54.15 IC2.1 71.32,53.92 71.32,53.01 74.07,50.27 74.07,38.61 80.47,32.21 80.47,31.75 IC1.23
/SHDN
  Top 0.254: SW2.4 126.19,46.38 126.19,51.87 115.09,62.97 115.09,87.17 119.33,91.42 IC7.18
  Bottom 0.254: IC7.18 119.56,91.64 122.53,91.64 R5.1
/STROBE
  Bottom 0.254: U1.4 145.16,87.07 136.7,87.07 122.3,101.47 122.3,102.16 121.61,102.84 108.58,102.84 107.44,101.7 X2.1
/WE
  Bottom 0.254: IC5.29 69.95,90.04 69.95,79.76 73.84,75.87 73.84,66.73 76.35,64.21 76.35,46.38 79.55,43.18 79.55,38.38 84.35,33.58 86.41,33.58 88.24,31.75 IC1.26
A0
  Bottom 0.254: IC5.12 90.3,74.73 90.3,71.3 91.21,70.38 91.21,65.35 93.73,62.84 93.73,58.95 96.7,55.98 96.7,48.67 97.61,47.75 IC3.19
A1
  Bottom 0.254: IC5.11 87.78,74.73 87.78,71.3 88.7,70.38 88.7,63.3 89.15,62.84 89.15,53.7 95.1,47.75 IC3.18
A2
  Bottom 0.254: IC5.10 85.27,74.73 85.27,71.3 86.64,69.93 86.64,53.7 92.58,47.75 IC3.17
A3
  Bottom 0.254: IC5.9 82.75,74.73 82.75,71.3 83.9,70.16 83.9,53.92 90.07,47.75 IC3.16
A4
  Bottom 0.254: IC5.8 80.01,74.73 80.01,71.3 78.87,70.16 78.87,64.9 81.38,62.38 81.38,53.92 87.55,47.75 IC3.15
A5  (via drill 0.61)
  Top 0.254: v81.38,64.9 83.9,62.38 83.9,60.55 87.1,57.35 90.3,57.35 91.21,56.44 91.21,53.47 86.64,48.9 86.64,45.7 85.5,44.55 84.58,44.55 84.12,45.01 84.12,46.38 85.27,47.52 IC3.14
  Bottom 0.254: v81.38,64.9 81.38,75.64 80.24,76.78 79.78,76.78 77.95,74.95 77.49,74.95 IC5.7
A6
  Bottom 0.254: IC5.6 74.98,74.73 74.98,66.27 78.87,62.38 78.87,51.41 82.52,47.75 IC3.13
A7  (via drill 0.61)
  Top 0.254: v74.07,53.24 79.55,47.75 80.01,47.75 IC3.12
  Bottom 0.254: v74.07,53.24 74.07,63.3 72.24,65.13 70.41,65.13 69.27,66.27 69.27,69.47 72.24,72.44 72.24,74.73 IC5.5
A8
  Top 0.254: IC5.27 74.98,90.27 75.44,90.27 77.95,92.79 87.78,92.79 89.15,91.42 89.15,81.36 93.73,76.78 95.55,76.78 96.7,75.64 96.7,62.61 97.61,61.7 IC4.19
A9
  Bottom 0.254: IC5.26 77.49,90.04 77.95,90.04 86.41,81.58 93.27,81.58 98.98,75.87 98.98,65.35 95.33,61.7 IC4.18
A10
  Top 0.254: IC5.23 85.27,90.04 85.27,79.53 88.7,76.1 88.7,65.58 92.58,61.7 IC4.17
A11  (via drill 0.61)
  Top 0.254: v89.84,65.81 89.15,66.5 89.15,76.33 86.64,78.84 86.64,90.73 85.5,91.87 84.58,91.87 83.9,91.19 83.9,89.36 82.98,88.44 82.07,88.44 80.47,90.04 80.01,90.04 IC5.25
  Bottom 0.254: v89.84,65.81 89.84,61.92 90.07,61.7 IC4.16
A12
  Top 0.254: IC4.15 87.55,61.7 87.1,61.7 82.3,66.5 77.95,66.5 69.72,74.73 IC5.4
A13  (via drill 0.61)
  Top 0.254: v83.9,78.61 83.9,73.36 86.64,70.61 86.64,64.67 88.7,62.61 88.7,60.55 88.01,59.87 86.87,59.87 85.27,61.47 IC4.14
  Bottom 0.254: v83.9,78.61 72.47,90.04 IC5.28
A14
  Top 0.254: IC4.13 82.52,61.7 82.07,61.7 75.67,68.1 69.95,68.1 67.44,70.61 67.44,74.73 IC5.3
A15  (via drill 0.61)
  Top 0.254: v76.12,78.84 64.92,90.04 IC5.31
  Bottom 0.254: v76.12,78.84 76.12,65.81 80.01,61.92 80.01,61.7 IC4.12
BUSY
  Top 0.254: U1.1 145.16,94.61 141.73,94.61 134.87,101.47 X2.11
CS  (via drill 0.61)
  Top 0.254: v132.36,18.49 132.36,12.78 LED2.C | v113.84,19.86 113.84,26.04 114.07,26.26 J1.1 | IC1.16 63.32,31.75 65.15,29.92 v74.75,29.92
  Bottom 0.254: v132.36,18.49 115.21,18.49 v113.84,19.86 112.57,18.59 96.6,18.59 91.9,23.29 89.38,23.29 85.04,27.64 80.92,27.64 80.01,28.55 78.18,28.55 76.81,29.92 v74.75,29.92
CTS0
  Top 0.254: IC7.9 111.78,71.3 113.61,73.13 113.61,91.87 106.07,99.42 77.95,99.42 76.12,101.24 76.12,103.99 X1.8
D0_A0
  Top 0.254: IC1.2 90.98,39.52 90.98,41.12 96.7,46.84 96.7,54.15 97.61,55.07 IC3.2
  Bottom 0.254: 94.18,67.41 96.01,67.41 97.61,69.01 IC4.2 | 94.18,67.41 92.35,67.41 91.67,68.1 91.67,70.38 92.58,71.3 92.58,74.73 IC5.13 | 94.18,67.41 94.18,59.18 97.61,55.75 97.61,55.3 IC3.2
D1_A1
  Top 0.254: IC5.14 95.33,74.73 95.33,69.24 IC4.3 95.33,69.01 95.33,63.75 96.24,62.84 96.24,56.21 95.33,55.3 IC3.3
  Bottom 0.254: IC1.3 88.47,39.52 94.87,45.92 95.78,45.92 96.24,46.38 96.24,54.15 95.33,55.07 IC3.3
D2_A2
  Top 0.254: IC1.4 85.72,39.52 85.72,40.89 91.67,46.84 91.67,54.15 92.58,55.07 IC3.4 92.81,55.3 93.73,56.21 93.73,62.84 92.81,63.75 92.81,69.01 IC4.4
  Bottom 0.254: IC4.4 92.81,69.24 92.81,69.93 97.61,74.73 IC5.15
D3_A3  (via drill 0.61)
  Top 0.254: IC1.5 83.21,39.52 83.21,46.15 83.9,46.84 83.9,51.87 86.64,54.61 86.64,56.44 87.1,56.9 88.47,56.9 90.07,55.3 IC3.5 | v92.58,79.53 100.13,87.07 100.13,90.04 IC5.17
  Bottom 0.254: IC3.5 90.3,55.3 91.21,56.21 91.21,62.84 90.75,63.3 90.75,66.27 90.3,66.73 90.3,69.01 IC4.5 90.07,69.24 89.15,70.16 89.15,76.1 v92.58,79.53
D4_A4  (via drill 0.61)
  Top 0.254: v85.04,45.47 86.18,46.61 86.18,53.47 87.78,55.07 IC3.6 | v91.21,80.67 97.61,87.07 97.61,90.04 IC5.18
  Bottom 0.254: v85.04,45.47 80.7,41.12 80.7,39.52 IC1.6 | IC3.6 87.78,55.3 88.7,56.21 88.7,62.61 87.78,63.52 87.78,69.01 IC4.6 87.55,69.24 87.55,69.7 86.64,70.61 86.64,76.1 v91.21,80.67
D5_A5
  Top 0.254: 76.12,77.47 76.81,76.78 77.72,76.78 78.87,75.64 78.87,72.44 81.38,69.93 81.38,68.1 82.07,67.41 83.44,67.41 85.04,69.01 IC4.7 | 76.12,77.47 74.52,79.07 68.58,79.07 65.84,76.33 65.84,68.56 67.89,66.5 67.89,39.52 IC1.11 | 76.12,77.47 77.04,78.38 77.04,79.3 73.38,82.96 73.38,91.42 75.67,93.7 91.67,93.7 95.1,90.27 IC5.19
  Bottom 0.254: IC3.7 85.27,55.3 85.27,59.64 86.18,60.55 86.18,68.1 85.27,69.01 IC4.7
D6_A6
  Top 0.254: 82.52,71.07 82.52,72.67 81.15,74.04 81.15,81.81 73.84,89.13 73.84,91.19 75.89,93.24 89.61,93.24 92.58,90.27 IC5.20 | 82.52,71.07 82.52,69.24 IC4.8 | 69.95,65.13 69.27,64.44 69.27,38.61 67.44,36.78 60.81,36.78 59.21,38.38 59.21,40.44 59.89,41.12 63.32,41.12 64.92,39.52 65.38,39.52 IC1.12 | 69.95,65.13 72.24,65.13 76.35,61.01 76.35,60.55 80.01,56.9 80.92,56.9 82.52,55.3 IC3.8 | 82.52,71.07 85.5,71.07 86.18,70.38 86.18,68.1 85.04,66.95 80.01,66.95 78.64,68.33 78.64,70.16 75.67,73.13 74.52,73.13 73.38,74.27 73.38,76.1 72.24,77.24 67.44,77.24 66.29,76.1 66.29,68.78 69.95,65.13
D7_A7  (via drill 0.61)
  Top 0.254: v73.15,62.38 80.01,55.52 80.01,55.3 IC3.9 | v70.18,78.16 73.84,78.16 76.12,75.87 76.12,74.04 80.01,70.16 80.01,69.24 IC4.9
  Bottom 0.254: 70.18,60.33 70.41,60.55 72.24,60.55 73.15,61.47 v73.15,62.38 | 70.18,60.33 65.38,55.52 62.87,55.52 61.72,54.38 61.72,53.47 62.87,52.32 62.87,39.52 IC1.13 | 70.18,60.33 68.81,61.7 68.81,76.1 70.18,77.47 v70.18,78.16 68.81,79.53 68.81,91.42 72.24,94.84 72.24,97.59 73.15,98.5 73.38,98.5 75.89,101.02 75.89,101.7 77.27,103.07 77.27,104.22 78.41,105.36 79.32,105.36 80.01,104.67 80.01,103.76 79.1,102.84 79.1,101.02 86.64,93.47 86.64,88.9 87.1,88.44 88.01,88.44 89.61,90.04 90.07,90.04 IC5.21
DATA0
  Bottom 0.254: U1.21 153.16,77.01 149.05,77.01 145.16,80.9 137.16,80.9 118.64,99.42 112.24,99.42 110.18,101.47 X2.2
DATA1
  Bottom 0.254: U1.22 153.16,79.53 149.28,79.53 145.85,82.96 135.79,82.96 118.87,99.87 114.53,99.87 112.93,101.47 X2.3
DATA2
  Bottom 0.254: U1.23 153.16,82.04 147.45,82.04 146.08,83.41 136.02,83.41 119.1,100.33 116.81,100.33 115.67,101.47 X2.4
DATA3
  Bottom 0.254: U1.24 153.16,84.56 146.76,84.56 145.85,85.47 134.65,85.47 118.41,101.7 X2.5
DATA4
  Bottom 0.254: U1.25 153.16,86.84 146.53,86.84 145.62,85.93 136.7,85.93 121.16,101.47 X2.6
DATA5
  Top 0.254: U1.26 153.16,89.59 146.76,89.59 145.39,90.96 134.42,90.96 123.9,101.47 X2.7
DATA6
  Top 0.254: U1.27 153.16,92.1 146.76,92.1 145.39,93.47 134.65,93.47 126.64,101.47 X2.8
DATA7
  Top 0.254: U1.28 153.16,94.61 149.05,94.61 140.82,102.84 130.53,102.84 129.39,101.7 X2.9
GND  (via drill 0.61)  (1 unrouted)
  Top 0.254: C27.- 154.08,47.75 154.08,51.64 154.31,51.87 C26.1 | C28.- 144.93,47.75 144.93,51.87 C29.1 144.93,52.09 146.08,53.24 147.22,53.24 | 147.22,53.24 149.76,53.24 149.76,67.39 145.39,71.75 U1.10 145.16,71.75 | 147.22,53.24 149.58,53.24 149.73,53.09 149.73,35.87 IC12.4 | 145.16,18.72 145.62,18.72 IC11.26 | 145.16,18.72 IC11.25 145.16,18.72 | 142.19,19.86 141.05,19.86 140.59,19.41 140.59,18.72 IC11.18 | 142.19,19.86 142.65,19.41 142.65,18.72 IC11.21 | 145.16,18.72 145.16,19.41 144.7,19.86 | 142.19,19.86 144.7,19.86 | IC11.7 143.1,26.04 143.1,27.64 141.73,29.01 C25.1 141.73,29.23 142.88,30.38 144.48,30.38 147.68,27.18 147.68,24.89 144.7,21.92 144.7,19.86 | C23.1 152.48,22.15 152.48,19.18 C22.1 152.48,18.95 154.53,16.89 154.53,14.61 | 154.53,14.61 C24.- 154.53,14.61 | 150.42,10.49 150.65,10.26 X3.S2 150.42,10.49 | 150.42,10.49 148.13,12.78 146.08,12.78 X3.4 145.85,12.78 143.33,10.26 138.76,10.26 X3.S1 138.53,10.03 138.53,8.2 133.5,3.17 132.08,3.17 | 150.42,10.49 154.53,14.61 | 132.08,3.17 121.16,3.17 J1.Z3 120.93,3.17 118.87,5.23 | 118.87,5.23 118.87,24.43 J1.Z2 | C9.2 104.01,66.73 102.64,66.73 100.35,69.01 IC4.1 100.35,69.24 100.35,74.73 IC5.16 | IC3.1 100.35,55.07 101.73,55.07 104.01,52.78 C8.2 | 136.25,104.22 133.5,104.22 X2.23 133.27,104.22 130.76,104.22 X2.22 130.53,104.22 128.02,104.22 X2.21 127.79,104.22 125.27,104.22 X2.20 125.04,104.22 122.53,104.22 X2.19 | 136.25,104.22 X2.24 136.25,104.22 | 136.25,104.22 138.99,104.22 X2.25 | X2.18 119.79,104.22 122.3,104.22 X2.19 | 134.65,73.66 134.65,74.04 | 134.65,73.66 134.65,76.1 C17.2 134.65,76.33 134.65,77.01 135.79,78.16 135.79,81.81 135.56,82.04 129.12,82.04 C18.2 129.12,83.12 126.09,86.16 123.21,86.16 C19.1 122.99,86.39 122.07,87.3 122.07,89.36 123.67,90.96 123.67,91.87 122.53,93.02 122.53,103.99 X2.19
  Top 0.254: IC8.9 129.16,71.3 131.9,71.3 134.26,73.66 134.65,73.66 | IC7.1 111.56,91.42 109.04,88.9 106.76,88.9 C13.2 106.53,88.9 105.61,87.99 105.61,75.64 106.53,74.73 106.53,73.81 C14.2 | IC10.4 46.41,33.81 46.41,35.87 45.95,36.32 45.95,45.92 47.55,47.52 SP1.- | 36.35,60.33 36.35,57.81 Q4.E | 36.35,60.33 R20.1 36.35,60.33 | IC13.9 32.46,56.67 32.46,58.95 IC13.10 | 36.35,60.33 36.35,67.18 38.63,69.47 38.63,74.73 IC6.4 38.86,74.95 41.15,74.95 IC6.3 41.38,74.95 41.38,83.64 45.72,87.99 45.72,89.36 G1.- 45.72,89.59 48.69,92.56 58.29,92.56 C11.2 | 30.17,101.93 30.17,100.33 X5.5 | 30.17,101.93 29.26,102.84 X5.10 29.03,103.07 28.12,103.07 27.2,103.99 25.6,103.99 24.69,103.07 X5.8 24.46,102.84 22.4,102.84 X5.7 22.17,102.84 20.12,102.84 X5.6 | 30.17,101.93 33.15,101.93 36.8,105.59 48.01,105.59 X6.3 | C5.2 75.67,43.18 75.67,39.52 IC1.8 75.67,39.29 75.67,38.84 81.84,32.66 81.84,30.84 80.92,29.92 80.01,29.92 78.18,31.75 IC1.22 | v75.44,53.24 77.27,55.07 IC3.10 | IC4.10 77.27,69.24 75.89,69.24 70.87,74.27 70.87,76.1 70.18,76.78 69.49,76.78 68.81,76.1 68.81,71.53 71.09,69.24 IC2.7 | C6.1 90.75,27.18 90.3,26.72 90.3,24.89 R3.2 90.07,24.66 88.47,24.66 83.67,19.86 81.61,19.86 80.7,20.78 C3.2 80.47,20.78 79.55,19.86 77.04,19.86 76.12,20.78 74.98,20.78 C4.2 74.75,21.01 72.92,21.01 70.64,23.29 66.75,23.29 SV1.6 | J1.6 101.69,25.08 103.56,23.22 106.63,23.22 109.19,25.78 J1.3 | J1.Z1 93.73,24.66 93.73,26.72 94.41,27.41 100.58,27.41 101.5,26.49 J1.6 | J1.6 101.5,26.26 101.5,25.12 89.38,13.01 85.72,13.01 C1.- | 4.57,48.9 4.57,51.41 IC14.1 4.57,51.64 4.57,58.04 13.95,67.41
  Top 0.254: 4.57,48.9 IC14.2 | 4.57,48.9 11.89,48.9 IC14.7 | 4.57,48.9 IC14.2 | 4.57,48.9 4.57,46.38 IC14.3 4.57,46.15 4.57,43.87 IC14.4 4.57,43.64 4.57,40.66 11.89,33.35 11.89,24.89 C32.2 | 4.57,48.9 IC14.2 | C36.- 8.46,70.61 13.26,70.61 C35.1 13.49,70.38 13.49,67.87 13.95,67.41 | 13.95,67.41 17.14,64.21 IC13.29 | S1.1 82.3,2.72 83.44,3.86 87.1,3.86 87.78,3.17 93.5,3.17 J1.Z4 93.73,3.17 95.78,5.23 118.87,5.23 | 33.83,9.35 31.77,9.35 31.32,8.89 R17.2 | 33.83,9.35 39.32,9.35 SV2.10 | IC9.3 47.78,24.89 50.06,24.89 IC9.2 50.29,24.89 52.58,24.89 IC9.1 52.81,24.89 65.61,12.09 66.52,12.09 SV3.5 | 33.83,24.89 34.75,24.89 IC9.8 | 33.83,24.89 31.32,24.89 C20.1 | 33.83,24.89 33.83,9.35 | C2.1 86.18,8.89 85.27,8.89 84.12,7.75 68.35,7.75 66.75,9.35 SV3.6 | LED1.C 132.08,4.96 132.08,3.17
  Top 0.406: U1.10 C21.2
  Top 0.61: SP1.- 53.98,53.98 C10.2
  Bottom 0.254: SW2.3 126.42,53.92 126.87,53.92 128.7,52.09 144.7,52.09 C29.1 | C27.- 153.85,47.75 153.39,47.75 152.48,48.67 146.08,48.67 145.16,47.75 C28.- 145.16,47.52 145.16,28.09 | 145.16,28.09 145.39,28.09 145.62,28.32 146.53,28.32 152.48,22.38 C23.1 | 145.16,28.09 143.79,28.09 142.88,29.01 141.73,29.01 C25.1 | C14.2 106.53,73.81 101.27,73.81 100.35,74.73 IC5.16 | C7.- 108.81,32.44 108.81,47.98 104.24,52.55 C8.2 | C9.2 104.01,66.5 104.01,65.58 101.5,63.07 101.5,56.44 100.35,55.3 IC3.1 | C19.1 122.99,86.39 119.56,86.39 IC7.16 119.33,86.39 116.81,86.39 111.78,91.42 IC7.1 | IC5.22 87.78,90.27 89.38,91.87 101.04,91.87 104.01,88.9 106.53,88.9 C13.2 | IC13.10 32.46,59.18 33.6,60.33 36.12,60.33 R20.1 36.35,60.33 47.55,49.12 47.55,47.75 SP1.- | X6.3 48.01,105.59 48.01,104.9 46.86,103.76 46.86,90.73 45.72,89.59 G1.- | X1.5 71.78,101.47 67.67,101.47 58.98,92.79 58.52,92.79 C11.2 | C5.2 75.44,43.18 v75.44,53.24 75.44,64.44 71.32,68.56 71.32,69.01 IC2.7 | IC1.22 78.18,31.75 81.38,28.55 89.61,28.55 90.75,27.41 C6.1 | C2.1 86.18,8.89 86.18,12.32 85.72,12.78 C1.- 85.72,13.01 85.72,13.46 80.7,18.49 80.7,20.78 C3.2 | SV3.5 66.75,11.86 66.75,9.58 SV3.6 66.75,9.35 67.89,9.35 74.52,2.72 82.07,2.72 S1.1 | 30.4,8.89 31.09,8.89 R17.2 | 30.4,8.89 26.06,8.89 R16.2 25.83,8.89 19.66,2.72 15.54,2.72 X4.1 | 30.4,8.89 30.4,4.55 30.63,4.32 30.63,2.72 S2.2 | C32.2 12.12,24.89 18.29,24.89 C34.2 18.52,24.89 31.09,24.89 C20.1 | IC9.3 47.55,24.89 47.09,24.89 45.49,26.49 36.58,26.49 34.98,24.89 IC9.8 | IC13.9 28.42,54.53 22.78,54.53 18.29,50.04 13.26,50.04 12.12,48.9 IC14.7
  pour Top (isolate 0.305): -0.64,114.94 160.66,114.94 160.66,-0.64 -0.64,-0.64
  pour Bottom (isolate 0.305): -0.64,114.94 160.66,114.94 160.66,-1.27 -0.64,-1.27
GPIO_0
  Top 0.254: IC9.4 45.26,24.66 45.26,19.18 46.63,17.8 46.63,13.92 48.46,12.09 48.46,10.49 49.38,9.58 SV2.2
GPIO_1
  Bottom 0.254: IC9.5 42.75,24.66 42.75,21.69 46.63,17.8 46.63,12.32 46.86,12.09 SV2.3
GPIO_2
  Bottom 0.254: IC9.6 40.01,24.66 40.01,21.92 43.89,18.03 43.89,14.15 45.95,12.09 45.95,10.49 46.86,9.58 SV2.4
GPIO_3
  Top 0.254: IC9.7 37.49,24.66 43.89,18.26 43.89,12.55 44.35,12.09 SV2.5
GPIO_4
  Bottom 0.254: IC9.9 34.98,17.12 38.86,13.23 39.78,13.23 40.69,12.32 40.69,11.63 41.61,10.72 43.21,10.72 44.35,9.58 SV2.6
GPIO_5
  Bottom 0.254: IC9.10 37.49,17.12 37.49,16.43 41.83,12.09 SV2.7
GPIO_6
  Top 0.254: IC9.11 40.01,17.12 40.01,14.38 38.18,12.55 38.18,11.63 39.09,10.72 40.69,10.72 41.83,9.58 SV2.8
GPIO_7
  Top 0.254: IC9.12 42.52,17.12 42.52,15.06 39.55,12.09 SV2.9
MISO_A9  (via drill 0.61)
  Top 0.254: J1.7 99.21,26.26 99.21,24.43 96.47,21.69 91.21,21.69 90.75,21.23 86.41,21.23 84.12,18.95 63.55,18.95 61.72,20.78 SV1.1 61.49,21.01 61.49,21.69 58.75,24.43 58.75,33.12 60.12,34.49 | 60.12,34.49 v65.15,34.49 | 60.12,34.49 58.75,35.87 58.75,40.66 65.61,47.52 65.61,62.61 65.38,62.84 65.38,69.47 63.78,71.07 63.78,91.42 64.24,91.87 65.15,91.87 66.75,90.27 67.21,90.27 IC5.30
  Bottom 0.254: v65.15,34.49 67.89,31.75 IC1.18
MOSI_A8
  Top 0.254: J1.2 111.56,26.49 109.73,28.32 108.2,29.84 105.41,29.84 103.89,28.32 93.95,28.32 91.21,25.58 91.21,24.21 90.3,23.29 87.78,23.29 83.9,19.41 69.72,19.41 66.75,22.38 65.15,22.38 64.24,23.29 SV1.4
  Bottom 0.254: 65.38,31.75 65.38,24.66 64.24,23.52 SV1.4 | 65.38,31.75 IC1.17 65.38,31.75 | 65.38,31.75 59.21,37.92 59.21,40.44 60.12,41.35 60.12,74.95 61.95,76.78 62.87,76.78 64.69,74.95 IC5.2
N$1
  Top 0.254: IC1.10 70.64,39.29 70.64,38.84 76.58,32.89 76.58,26.26 76.35,26.04 Q1.1
  Bottom 0.254: Q1.1 76.35,26.04 76.35,21.92 77.27,21.01 C4.1
N$2
  Top 0.254: 46.41,78.61 Q2.1
  Top 0.406: IC6.1 46.36,78.56 46.41,78.61
  Top 0.61: C12.2 46.36,74.33 IC6.1
N$3  (via drill 0.61)
  Top 0.254: v139.9,15.06 138.07,16.89 138.07,19.63 138.3,19.86 138.99,19.86 139.22,19.63 139.22,18.72 IC11.16
  Bottom 0.254: v139.9,15.06 143.33,15.06 X3.2
N$4
  Top 0.406: IC6.2 44.45,75.56 44.45,80.64 45.09,81.28 Q2.2
N$5
  Top 0.254: IC2.3 71.32,58.95 71.32,58.5 73.15,56.67 73.15,51.87 77.27,47.75 IC3.11
N$6
  Top 0.254: IC11.15 138.76,18.49 138.76,17.58 143.33,13.01 X3.3
N$7
  Top 0.254: LED1.A 130.53,5.23 126.42,5.23 R1.1
N$8  (via drill 0.61)
  Top 0.254: R7.1 134.42,78.84 133.5,77.93 133.5,76.33 C17.1 133.27,76.1 130.53,76.1 130.07,75.64 Q3.3 129.84,75.64 128.47,77.01 127.1,77.01 v125.73,75.64 | v123.9,74.95 124.36,74.5 124.36,71.3 IC8.16
  Bottom 0.254: v123.9,74.95 125.04,74.95 v125.73,75.64
N$9
  Top 0.254: 106.76,86.39 C16.2 | 111.56,88.9 IC7.2
  Top 0.406: 106.76,86.39 109.04,86.39 111.56,88.9
N$10
  Top 0.61: JP1.2 73.35,96.83 X1.9
N$11
  Top 0.254: 106.76,81.36 C15.1 | 111.56,81.36 IC7.5
  Top 0.406: 111.56,81.36 106.76,81.36
N$12
  Top 0.254: 106.76,76.33 C14.1 | 111.56,76.33 IC7.7
  Top 0.406: 111.56,76.33 106.76,76.33
N$13
  Top 0.254: LED2.A 130.53,12.78 130.3,12.78 130.07,13.01 126.64,13.01 126.42,12.78 R4.1
N$14
  Top 0.254: 106.76,83.87 C16.1 | 111.56,83.87 IC7.4
  Top 0.406: 111.56,83.87 106.76,83.87
N$15
  Top 0.254: 106.76,78.84 C15.2 | 111.56,78.84 IC7.6
  Top 0.406: 111.56,78.84 106.76,78.84
N$16
  Top 0.254: IC11.14 138.53,26.04 138.53,29.01 R13.1
N$17
  Bottom 0.254: IC7.3 111.56,86.39 106.53,91.42 C13.1
N$18
  Top 0.254: D1.1 52.81,79.3 52.81,76.33 D2.1
  Bottom 0.254: IC6.8 52.71,67.33 D2.1
N$19
  Top 0.254: D1.2 52.58,82.04 52.58,84.1 50.98,85.7 G1.+
N$20
  Top 0.254: 17.14,61.7 IC13.30 | 10.97,62.61 Q5.1
  Top 0.406: 17.14,61.7 11.89,61.7 10.97,62.61
N$21
  Bottom 0.254: R21.1 10.29,95.99 11.89,95.99 12.8,96.9 15.54,96.9 16.46,95.99 R22.1 16.69,95.99 21.03,100.33 X5.1
N$22
  Top 0.254: R21.2 10.29,93.24 10.29,77.7 15.32,72.67 15.32,68.56 17.14,66.73 IC13.28
N$23
  Top 0.254: 127.56,81.13 127.56,79.53 Q3.1 | 127.56,81.13 127.56,82.45 C18.1 | 127.56,79.3 Q3.1 | 127.56,81.13 134.42,81.13 R7.2 | 127.56,79.3 124.82,76.56 124.82,75.18 125.04,74.95 125.04,71.3 IC8.15 | 127.56,79.3 Q3.1
N$24
  Top 0.254: C3.1 82.98,21.01 81.15,22.84 Q1.2 77.04,30.15 77.04,33.12 73.15,37.01 73.15,39.29 IC1.9
N$25
  Bottom 0.254: R22.2 16.46,93.24 16.46,85.93 15.32,84.78 15.32,71.07 17.14,69.24 IC13.27
N$26
  Top 0.254: 19.2,96.44 19.66,95.99 R24.1 | 19.2,96.44 18.74,96.9 16,96.9 15.09,95.99 13.49,95.99 R23.1 | 19.2,96.44 19.43,96.44 23.32,100.33 X5.2
N$27
  Top 0.254: IC13.26 13.49,75.41 13.49,93.24 R23.2
N$28
  Top 0.254: IC13.25 17.14,74.5 14.86,76.78 14.86,88.44 19.66,93.24 R24.2
N$29
  Top 0.254: 25.15,99.87 25.6,100.33 X5.3 25.15,99.87 | 25.15,99.87 22.86,97.59 22.86,95.99 R25.1 | 25.15,99.87 29.03,95.99 R26.1
N$30
  Top 0.254: IC13.24 17.14,77.01 15.32,78.84 15.32,85.7 22.86,93.24 R25.2
N$31
  Top 0.254: IC13.23 17.14,79.53 29.03,91.42 29.03,93.24 R26.2
N$32
  Top 0.254: IC11.17 139.9,18.72 139.9,21.92 141.28,23.29 144.7,23.29 145.16,23.75 145.16,25.81 IC11.4 145.16,26.04 145.16,26.72 144.25,27.64 144.25,29.01 C25.2
N$33
  Top 0.254: IC13.22 17.14,82.04 25.83,90.73 25.83,93.24 R27.2
N$34
  Bottom 0.254: IC13.21 17.14,84.56 23.55,84.56 32.23,93.24 R28.2
N$35
  Bottom 0.254: R27.1 26.06,95.99 26.06,99.19 26.75,99.87 26.75,101.24 25.6,102.39 25.6,105.36 X5.13
N$36
  Bottom 0.254: R28.1 32.23,95.99 32.23,101.24 28.12,105.36 X5.14
N$37
  Top 0.254: 50.29,99.19 50.75,99.19 R32.1 50.29,99.19 | 50.29,99.19 48.46,99.19 R33.2 | 50.29,99.19 50.29,105.59 X6.1
N$38
  Top 0.254: 45.72,99.19 43.21,99.19 R31.1 | 45.72,99.19 R34.2 45.72,99.19 | 45.72,99.19 48.01,101.47 48.01,103.07 X6.5
N$39
  Top 0.254: 10.97,58.04 Q5.2 | 17.14,58.95 IC13.31
  Top 0.406: 10.97,58.04 16.23,58.04 17.14,58.95
N$40
  Top 0.254: IC4.11 77.27,61.7 76.35,61.7 71.32,66.73 IC2.6
N$41
  Top 0.254: IC13.2 32.46,38.84 40.01,46.38 40.01,47.52 SP1.+
N$42
  Top 0.254: C33.2 41.15,57.58 38.63,57.58 Q4.B 38.63,57.81 38.63,60.33 R20.2
N$43
  Top 0.254: LED3.C 132.13,7.75 132.13,8.89 131.45,9.58 131.45,23.75 138.3,30.61 142.42,30.61 142.65,30.84 144.7,30.84 148.13,27.41 148.13,18.03 147.45,17.35 144.25,17.35 143.79,17.8 143.79,18.49 IC11.23
N$44
  Top 0.254: LED4.C 132.36,10.26 136.02,10.26 138.07,12.32 142.42,12.32 143.1,11.63 144.02,11.63 144.7,12.32 144.7,16.2 143.1,17.8 143.1,18.49 IC11.22
N$45
  Top 0.254: R15.1 127.61,10.16 127.85,9.92 130.94,9.92 LED4.A
N$46
  Top 0.254: LED3.A 130.53,7.75 126.42,7.75 R14.1
N$47
  Bottom 0.254: 16,42.49 17.14,43.64 IC13.37 | 16,42.49 13.03,39.52 12.12,39.52 R29.2 | 16,42.49 15.77,42.49 12.12,46.15 IC14.6
N$48
  Top 0.254: 15.77,39.98 17.14,41.35 IC13.38 | 15.77,39.98 12.12,36.32 R30.2 | 15.77,39.98 12.12,43.64 IC14.5
N$49  (via drill 0.61)
  Top 0.254: v126.42,72.44 125.73,71.75 125.73,71.3 IC8.14 | v135.33,64.44 135.33,63.3 135.1,63.07 R8.2
  Bottom 0.254: v126.42,72.44 127.33,72.44 v135.33,64.44
N$50
  Top 0.254: IC8.7 128.47,65.58 128.47,66.27 129.16,66.95 134.42,66.95 R6.1
N$62
  Top 0.254: R16.1 26.06,11.63 26.06,14.61 R19.2 25.83,14.61 22.86,14.61 18.52,18.95 C31.- 18.52,19.18 18.52,22.15 C34.1
N$63
  Top 0.254: C32.1 12.12,22.15 12.12,19.18 C30.- | R18.2 28.57,15.06 28.57,14.15 31.09,11.63 R17.1
  Bottom 0.254: C30.- 12.12,18.95 16.92,18.95 18.06,17.8 23.77,17.8 25.83,15.75 28.12,15.75 28.57,15.29 R18.2
N$64
  Top 0.254: 10.97,10.95 10.52,10.49 X4.2 10.97,10.95 | 10.97,10.95 11.89,11.86 11.89,16.43 C30.+ | 10.97,10.95 12.8,9.12 X4.3
N$65
  Top 0.254: C31.+ 18.52,16.43 18.52,14.38 19.43,13.46 X4.4 19.66,13.23 20.12,12.78 20.12,5.92 X4.5
P10  (via drill 0.61)
  Top 0.254: v26.75,60.55 26.75,27.64 31.09,23.29 31.09,15.29 R18.1
  Bottom 0.254: v26.75,60.55 26.75,68.78 32.23,74.27 IC13.16
P11
  Top 0.254: R19.1 25.83,17.35 25.83,27.18 25.38,27.64 25.38,64.9 32.23,71.75 IC13.15
P26
  Top 0.254: IC13.35 17.14,49.35 24.46,56.67 24.46,79.3 42.75,97.59 49.84,97.59 50.75,96.67 R32.2
P27
  Top 0.254: IC13.36 17.14,46.38 24.92,54.15 24.92,79.07 42.29,96.44 42.98,96.44 R31.2
PAPER_OUT
  Bottom 0.254: U1.3 145.16,89.59 145.16,90.73 137.62,98.27 137.62,101.47 X2.12
PROP_RESET
  Top 0.254: Q4.C 37.26,55.52 36.8,55.52 34.06,58.27 34.06,59.87 32.46,61.47 IC13.11 32.23,61.47 26.29,61.47 25.83,61.01 25.83,27.86 27.2,26.49 27.2,5 26.52,4.32 26.52,2.72 S2.1
RESET_CPM  (via drill 0.61)
  Top 0.254: v83.9,23.52 83.9,25.81 86.87,28.78 86.87,32.44 93.27,38.84 93.27,39.29 IC1.1
  Bottom 0.254: 86.41,7.75 87.55,7.75 88.7,8.89 R2.2 | 86.41,7.75 85.95,7.75 84.81,8.89 83.9,8.89 C2.2 83.67,8.89 69.27,23.29 69.04,23.29 | 86.41,7.75 86.41,4.55 86.64,4.32 86.64,2.72 S1.2 | IC13.1 33.89,34.19 43.66,34.19 49.35,28.5 58.12,28.5 63.09,23.52 63.09,23.06 64.01,22.15 65.38,22.15 66.52,21.01 SV1.5 66.75,21.01 69.04,23.29 | v83.9,23.52 80.47,23.52 76.81,27.18 72.92,27.18 69.04,23.29
RTS0
  Bottom 0.254: IC7.8 111.56,73.81 110.64,73.81 106.76,77.7 97.84,77.7 87.55,87.99 86.87,87.99 86.18,88.67 86.18,93.24 78.64,100.79 78.64,103.99 X1.7
RXD0
  Bottom 0.254: IC7.14 119.33,81.36 116.36,81.36 112.47,85.24 110.64,85.24 107.67,88.21 107.67,89.36 106.76,90.27 103.33,90.27 93.73,99.87 81.84,99.87 80.24,101.47 X1.2
RXD_232  (via drill 0.61)
  Top 0.254: v125.96,69.7 126.42,70.16 126.42,71.07 IC8.13 | v132.59,61.24 132.59,48.9 131.45,47.75 131.45,46.38 SW2.6
  Bottom 0.254: IC7.13 119.56,78.61 121.16,77.01 121.16,76.33 125.96,71.53 v125.96,69.7 132.59,63.07 v132.59,61.24
RXD_CPM  (via drill 0.61)
  Top 0.254: v66.98,37.69 62.41,37.69 60.81,39.29 60.35,39.29 IC1.14
  Bottom 0.254: SW1.11 128.7,34.49 127.1,36.09 125.96,36.09 124.36,34.49 123.9,34.49 SW1.9 123.67,34.27 110.34,20.93 102.95,20.93 94.87,29.01 86.18,29.01 84.58,30.61 84.58,32.44 79.1,37.92 79.1,40.66 78.64,41.12 77.72,41.12 77.04,40.44 77.04,38.61 76.12,37.69 v66.98,37.69
RXD_USB  (via drill 0.61)
  Top 0.254: SW1.8 121.39,34.49 121.84,34.49 123.44,36.09 124.59,36.09 126.19,34.49 SW1.10 | v144.25,24.21 144.48,24.43 144.48,25.81 IC11.5
  Bottom 0.254: v144.25,24.21 139.45,29.01 139.45,36.09 129.39,46.15 128.93,46.15 SW2.5 128.7,46.15 127.1,44.55 121.84,44.55 120.24,42.95 120.24,40.66 121.16,39.75 121.16,34.49 SW1.8
RXD_VT100
  Top 0.254: 120.7,32.44 118.87,34.27 SW1.7 | 120.7,32.44 129.62,32.44 131.45,34.27 SW1.12 | 120.7,32.44 115.67,27.41 115.67,26.04 114.76,25.12 114.76,19.41 103.1,7.75 85.72,7.75 79.32,1.35 25.83,1.35 23.55,3.63 23.55,13.01 18.74,17.8 18.06,17.8 17.14,18.72 17.14,36.09 IC13.40
SCK_A10
  Top 0.254: J1.5 104.01,26.49 103.33,26.49 101.96,27.86 94.18,27.86 91.67,25.35 91.67,23.75 90.3,22.38 R3.1 | SV1.3 64.01,21.01 64.01,22.15 62.64,23.52 62.64,27.18 59.21,30.61 59.21,32.89 59.89,33.58 68.58,33.58 70.41,31.75 IC1.19
  Bottom 0.254: R3.1 90.07,22.38 89.61,22.38 84.81,27.18 80.7,27.18 79.78,28.09 74.3,28.09 70.64,31.75 IC1.19 70.41,31.75 66.75,35.41 64.69,35.41 61.72,38.38 61.72,40.21 61.27,40.66 61.27,69.24 62.18,70.16 62.18,74.73 IC5.1
SCL
  Top 0.254: 107.11,44.09 105.84,44.09 93.5,31.75 IC1.28 | 107.11,44.09 126.19,44.09 127.56,45.47 127.56,55.07 127.1,55.52 127.1,65.35 IC8.5 | IC10.7 41.15,31.29 38.63,31.29 37.03,32.89 R12.1 | 42.06,31.29 43.21,32.44 43.21,37.01 42.75,37.47 42.75,58.5 41.38,59.87 41.38,67.18 IC6.6 41.38,67.41 42.98,69.01 48.59,69.01 53.95,74.37 53.95,76.56 63.32,85.93 63.32,91.64 65.84,94.16 98.53,94.16 101.5,91.19 101.5,77.24 107.11,71.63 107.11,44.09 | 42.06,31.29 41.38,31.29 IC10.7 | 42.06,31.29 46.18,27.18 46.18,23.98 47.55,22.61 47.55,17.35 IC9.14 47.78,17.12 53.95,10.95 69.27,10.95 70.64,9.58 71.55,9.58 SV3.2 | 42.06,31.29 IC10.7
SCLA  (via drill 0.61)
  Top 0.254: 50.52,31.98 50.75,32.21 R9.1 50.52,31.98 | 50.52,31.98 49.84,31.29 46.63,31.29 IC10.2 | v133.5,38.61 133.5,46.76 146.3,59.56 146.3,64.67 145.39,65.58 145.39,66.5 U1.12 | v95.78,20.78 86.64,20.78 77.95,12.09 71.78,12.09 SV3.1 71.55,12.09 70.41,13.23 67.67,13.23 60.35,20.55 60.35,22.15 50.52,31.98
  Bottom 0.254: v133.5,38.61 130.07,35.18 130.07,33.35 117.68,20.95 112.39,20.95 111.12,19.68 96.88,19.68 v95.78,20.78
SDA  (via drill 0.61)
  Top 0.254: v128.02,63.98 127.79,64.21 127.79,65.35 IC8.6 | 41.61,37.92 42.75,36.78 42.75,33.12 42.06,32.44 41.38,32.44 IC10.6 | 41.61,37.92 39.78,37.92 38.86,37.01 R11.1 | 41.61,37.92 42.29,38.61 42.29,58.27 38.86,61.7 38.86,67.18 IC6.5 | v101.5,23.75 100.81,23.75 89.61,12.55 86.87,12.55 85.5,11.18 v73.15,11.18
  Bottom 0.254: v128.02,63.98 113.84,63.98 98.98,49.12 98.98,39.75 93.27,34.04 | 93.27,34.04 90.98,31.75 IC1.27 | R11.1 38.63,37.01 38.41,37.24 31.32,37.24 30.63,36.55 30.63,35.18 38.86,26.95 47.55,26.95 48.69,25.81 48.69,23.98 50.06,22.61 50.06,17.35 IC9.15 50.06,17.12 50.06,14.15 48.46,12.55 48.46,11.63 49.15,10.95 58.98,10.95 61.27,13.23 66.98,13.23 68.12,12.09 68.12,10.49 69.04,9.58 SV3.4 69.27,9.58 70.41,10.72 72.01,10.72 72.47,11.18 v73.15,11.18 | 93.27,34.04 101.5,25.81 v101.5,23.75
SDAA
  Top 0.254: R10.1 47.09,36.78 48.01,35.87 48.01,33.35 47.09,32.44 46.63,32.44 IC10.3 46.41,32.21 45.49,32.21 44.81,31.52 44.81,29.46 47.78,26.49 53.26,26.49 58.52,21.23 58.52,20.78 66.06,13.23 66.98,13.23 68.12,12.09 69.04,12.09 SV3.3 69.27,11.86 70.18,10.95 72.01,10.95 72.69,10.26 98.07,10.26 113.16,25.35 113.16,30.84 118.87,36.55 128.25,36.55 133.05,41.35 133.05,50.95 145.16,63.07 145.16,63.98 U1.13
TXD0
  Top 0.254: IC7.15 119.56,83.87 119.56,84.33 121.16,85.93 121.16,91.87 113.16,99.87 79.1,99.87 77.49,101.47 X1.3
TXD_232  (via drill 0.61)
  Top 0.254: v124.59,69.24 125.04,68.78 126.42,68.78 127.1,69.47 127.1,71.07 IC8.12
  Bottom 0.254: IC7.12 119.56,76.1 124.59,71.07 v124.59,69.24 128.93,64.9 128.93,54.15 SW2.2
TXD_CPM  (via drill 0.61)
  Top 0.254: v72.92,28.09 71.55,29.46 62.64,29.46 60.35,31.75 IC1.15 | v85.04,25.58 89.38,29.92 94.61,29.92 104.9,40.21 124.59,40.21 126.19,41.81 SW1.3 126.42,41.81 128.02,40.21 129.39,40.21 130.99,41.81 131.45,41.81 SW1.1
  Bottom 0.254: v72.92,28.09 73.61,28.09 74.07,27.64 77.95,27.64 80.7,24.89 84.35,24.89 v85.04,25.58
TXD_USB  (via drill 0.61)
  Top 0.254: v146.08,27.41 146.53,27.41 146.99,26.95 146.99,26.04 IC11.1 | SW1.6 118.87,42.04 120.47,43.64 122.07,43.64 123.67,42.04 SW1.4 123.9,42.04 125.5,43.64 128.47,43.64 130.07,45.24 130.07,47.07 131.45,48.44 131.45,53.92 SW2.1
  Bottom 0.254: v146.08,27.41 141.96,27.41 139.9,29.46 139.9,39.98 131.67,48.21 124.82,48.21 118.64,42.04 SW1.6
TXD_VT100
  Bottom 0.254: IC13.39 17.14,38.61 18.29,38.61 31.09,25.81 31.55,25.81 38.86,18.49 38.86,16.2 41.83,13.23 42.29,13.23 43.21,12.32 43.21,11.63 44.12,10.72 44.81,10.72 45.95,9.58 45.95,8.89 53.49,1.35 113.39,1.35 123.67,11.63 127.1,11.63 132.59,17.12 137.85,17.12 141.73,21.01 141.73,24.43 134.42,31.75 134.42,39.06 133.27,40.21 130.53,40.21 128.93,41.81 SW1.2 128.7,42.04 127.1,43.64 123.44,43.64 121.84,42.04 121.39,42.04 SW1.5
VT100_RESET  (via drill 0.61)
  Top 0.254: v140.82,21.46 143.56,21.46 146.53,24.43 146.53,25.81 IC11.2 | v77.27,22.38 72.24,22.38 66.06,28.55 v63.78,28.55
  Bottom 0.254: v140.82,21.46 136.7,21.46 132.82,17.58 88.01,17.58 83.21,22.38 v77.27,22.38 | v63.78,28.55 61.49,30.84 61.49,34.95 49.84,46.61 49.84,51.64 43.89,57.58 C33.1

## Text on the board
tNames: Aeternum V1.2 | IC8 | 3 | 2 | 1 | OFF | ON | Buzzer | OFF | ON | 6 | 5 | 4 | 3 | 2 | 1 | ISP | GPIO | I2C-Bus | www.openmechatronics.de | J. Grabow 02/2019